# Altium project bms_sub.PrjPcb
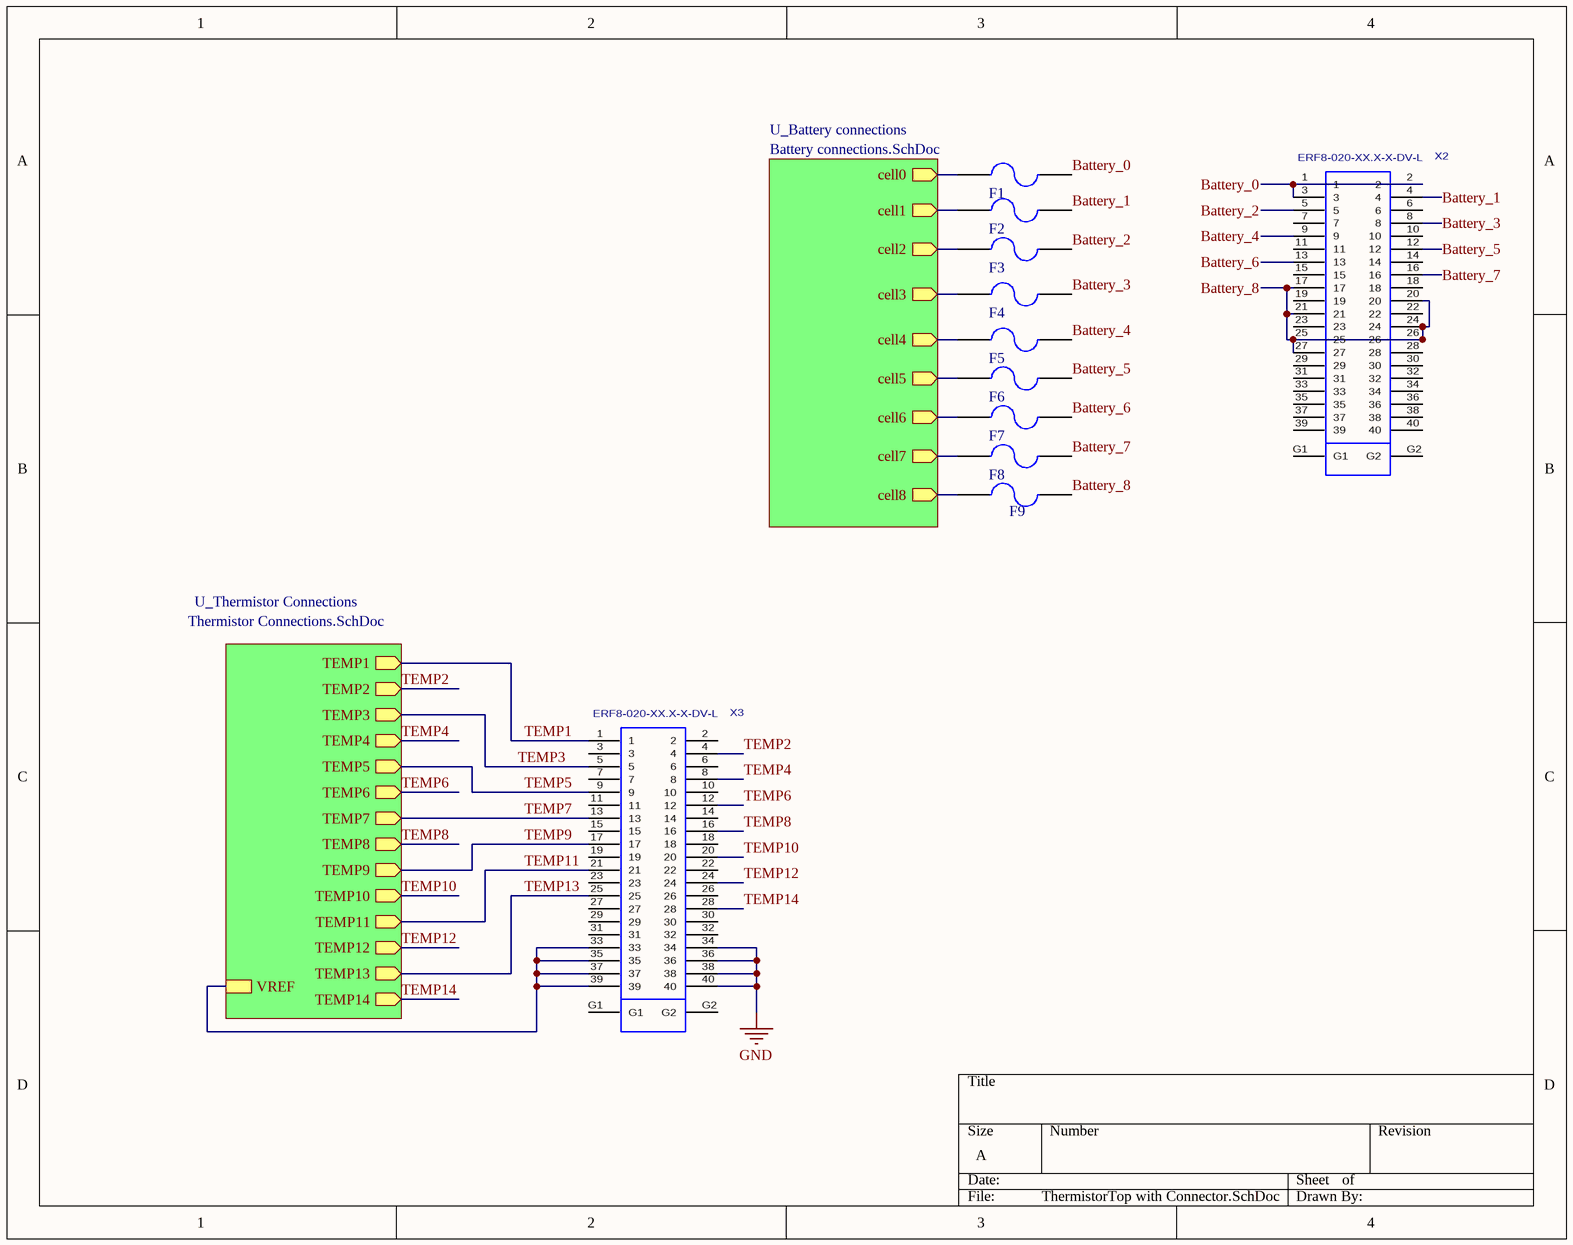
[diagram p0: ThermistorTop with Connector.SchDoc]
4 sheets, 62 parts. Net scope: hierarchical (ports join the sheet entries above them; power ports are global).
Board file: bms_sub.PcbDoc
Sheets:
  ThermistorTop with Connector.SchDoc
    U_Battery connections = Battery connections.SchDoc
    U_Thermistor Connections = Thermistor Connections.SchDoc
      U_Thermistor Linearization = Thermistor Linearization.SchDoc
      U_Thermistor Linearization = Thermistor Linearization.SchDoc
      U_Thermistor Linearization = Thermistor Linearization.SchDoc
      U_Thermistor Linearization = Thermistor Linearization.SchDoc
      U_Thermistor Linearization = Thermistor Linearization.SchDoc
      U_Thermistor Linearization = Thermistor Linearization.SchDoc
      U_Thermistor Linearization = Thermistor Linearization.SchDoc
      U_Thermistor Linearization = Thermistor Linearization.SchDoc
      U_Thermistor Linearization = Thermistor Linearization.SchDoc
      U_Thermistor Linearization = Thermistor Linearization.SchDoc
      U_Thermistor Linearization = Thermistor Linearization.SchDoc
      U_Thermistor Linearization = Thermistor Linearization.SchDoc
      U_Thermistor Linearization = Thermistor Linearization.SchDoc
      U_Thermistor Linearization = Thermistor Linearization.SchDoc

## Sheet ThermistorTop with Connector.SchDoc
size A

### Parts
(Parts that share a designator on the sheet are numbered #1, #2 ... from top to bottom, then left to right.)
F1  Fuse  [NTC 0805/2012]  (value not drawn)
F2  Fuse  [NTC 0805/2012]  (value not drawn)
F3  Fuse  [NTC 0805/2012]  (value not drawn)
F4  Fuse  [NTC 0805/2012]  (value not drawn)
F5  Fuse  [NTC 0805/2012]  (value not drawn)
F6  Fuse  [NTC 0805/2012]  (value not drawn)
F7  Fuse  [NTC 0805/2012]  (value not drawn)
F8  Fuse  [NTC 0805/2012]  (value not drawn)
F9  Fuse  [NTC 0805/2012]  (value not drawn)
X2#1  ERF8-020-XX.X-X-DV-L  [ERF8-020-XX.X-X-DV-L]
X3#1  ERF8-020-XX.X-X-DV-L  [ERF8-020-XX.X-X-DV-L]

### Sub-sheets
U_Battery connections = Battery connections.SchDoc: cell0 (out), cell1 (out), cell2 (out), cell3 (out), cell4 (out), cell5 (out), cell6 (out), cell7 (out), cell8 (out)
U_Thermistor Connections = Thermistor Connections.SchDoc: VREF, TEMP1 (out), TEMP2 (out), TEMP3 (out), TEMP4 (out), TEMP5 (out), TEMP6 (out), TEMP7 (out), TEMP8 (out), TEMP9 (out), TEMP10 (out), TEMP11 (out), TEMP12 (out), TEMP13 (out), TEMP14 (out)

### Nets
GND: X3#1.34 X3#1.36 X3#1.38 X3#1.40
Battery_0: F1.2 X2#1.1 X2#1.2 X2#1.3
Battery_1: F2.2 X2#1.4
Battery_2: F3.2 X2#1.5
Battery_3: F4.2 X2#1.8
Battery_4: F5.2 X2#1.9
Battery_5: F6.2 X2#1.12
Battery_6: F7.2 X2#1.13
Battery_7: F8.2 X2#1.16
Battery_8: F9.2 X2#1.17 X2#1.20 X2#1.21 X2#1.24 X2#1.25 X2#1.26 X2#1.27
TEMP1: X3#1.1 ; sheet U_Thermistor Connections/TEMP1
TEMP2: X3#1.4 ; sheet U_Thermistor Connections/TEMP2
TEMP3: X3#1.5 ; sheet U_Thermistor Connections/TEMP3
TEMP4: X3#1.8 ; sheet U_Thermistor Connections/TEMP4
TEMP5: X3#1.9 ; sheet U_Thermistor Connections/TEMP5
TEMP6: X3#1.12 ; sheet U_Thermistor Connections/TEMP6
TEMP7: X3#1.13 ; sheet U_Thermistor Connections/TEMP7
TEMP8: X3#1.16 ; sheet U_Thermistor Connections/TEMP8
TEMP9: X3#1.17 ; sheet U_Thermistor Connections/TEMP9
TEMP10: X3#1.20 ; sheet U_Thermistor Connections/TEMP10
TEMP11: X3#1.21 ; sheet U_Thermistor Connections/TEMP11
TEMP12: X3#1.24 ; sheet U_Thermistor Connections/TEMP12
TEMP13: X3#1.25 ; sheet U_Thermistor Connections/TEMP13
TEMP14: X3#1.28 ; sheet U_Thermistor Connections/TEMP14
NetBT1_1: F1.1 ; sheet U_Battery connections/cell0
NetBT2_1: F2.1 ; sheet U_Battery connections/cell1
NetBT3_1: F3.1 ; sheet U_Battery connections/cell2
NetBT4_1: F4.1 ; sheet U_Battery connections/cell3
NetBT5_1: F5.1 ; sheet U_Battery connections/cell4
NetBT6_1: F6.1 ; sheet U_Battery connections/cell5
NetBT7_1: F7.1 ; sheet U_Battery connections/cell6
NetBT8_1: F8.1 ; sheet U_Battery connections/cell7
NetBT9_1: F9.1 ; sheet U_Battery connections/cell8
NetRp1_1: X3#1.33 X3#1.35 X3#1.37 X3#1.39 ; sheet U_Thermistor Connections/VREF

Not connected (* = marked no-connect by the designer): X2#1 6 7 10 11 14 15 18 19 22 23 28 29 30 31 32 33 34 35 36 37 38 39 40 G1 G2; X3#1 2 3 6 7 10 11 14 15 18 19 22 23 26 27 29 30 31 32 G1 G2

### Library data of the parts
F1-F9 = 12: FUSE BOARD MOUNT 1A 32VDC 0805; id: 12; Name: MFU0805FF01000P100; itrip: 1; iinterrupt: 50; vmax: 32; quantity: 0; link: https://www.digikey.com/product-detail/en/vishay-beyschlag/MFU0805FF01000P100/MFU08051.00CT-ND/1206546; createdby: Haley
X2#1 X3#1 = 36: MANUFACTURER: SAMTEC; PCB DECAL: ERM8-020-XX.X-X-DV-L; id: 36; numcontacts: 40; numrows: 2; CREATED: August 17, 2016 - Wendy Xin; name: ERF8-020-XX.X-X-DV-L; quantity: 0; link: https://www.digikey.com/product-detail/en/samtec-inc/ERF8-020-05.0-S-DV-L-TR/SAM13554CT-ND/9593848; createdby: Haley

## Sheet Battery connections.SchDoc
size A
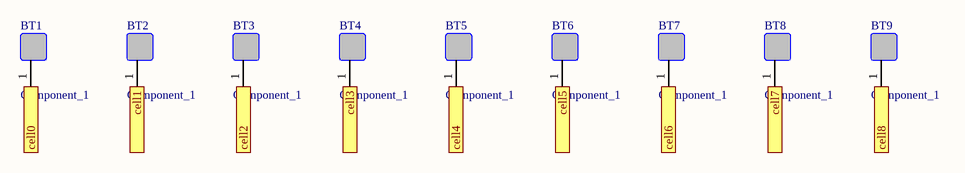
[diagram p1: Battery connections.SchDoc]

### Parts
BT1  Component_1  [Battery pad]
BT2  Component_1  [Battery pad]
BT3  Component_1  [Battery pad]
BT4  Component_1  [Battery pad]
BT5  Component_1  [Battery pad]
BT6  Component_1  [Battery pad]
BT7  Component_1  [Battery pad]
BT8  Component_1  [Battery pad]
BT9  Component_1  [Battery pad]

### Ports
cell0 (out), cell1 (out), cell2 (out), cell3 (out), cell4 (out), cell5 (out), cell6 (out), cell7 (out), cell8 (out)

### Nets
NetBT1_1: BT1.1(pin_1) ; port cell0
NetBT2_1: BT2.1(pin_1) ; port cell1
NetBT3_1: BT3.1(pin_1) ; port cell2
NetBT4_1: BT4.1(pin_1) ; port cell3
NetBT5_1: BT5.1(pin_1) ; port cell4
NetBT6_1: BT6.1(pin_1) ; port cell5
NetBT7_1: BT7.1(pin_1) ; port cell6
NetBT8_1: BT8.1(pin_1) ; port cell7
NetBT9_1: BT9.1(pin_1) ; port cell8

## Sheet Thermistor Connections.SchDoc
size A
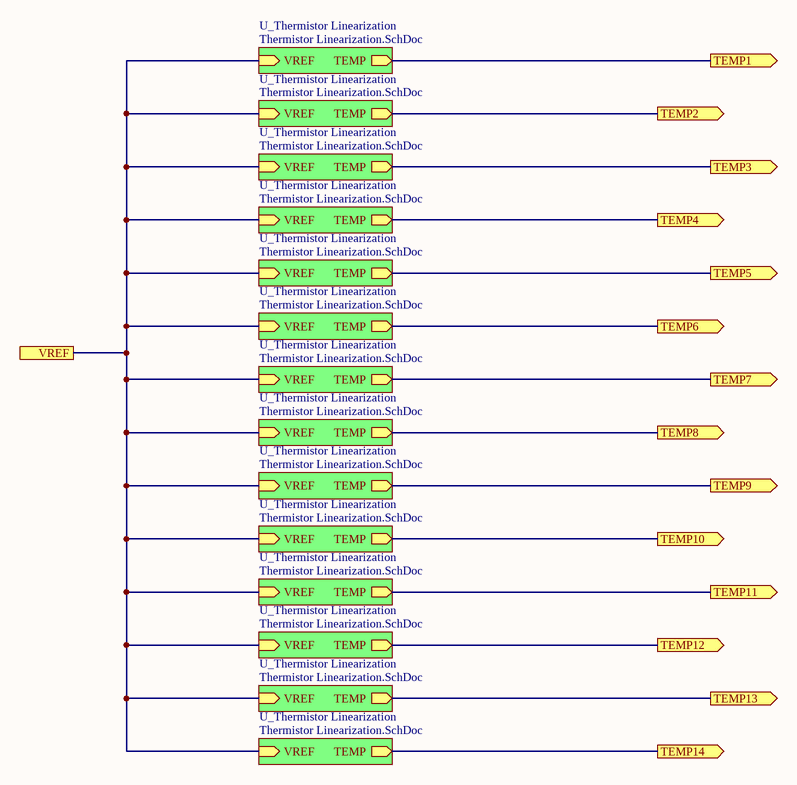
[diagram p2: Thermistor Connections.SchDoc]

### Sub-sheets
U_Thermistor Linearization = Thermistor Linearization.SchDoc: VREF (in), TEMP (out)
U_Thermistor Linearization = Thermistor Linearization.SchDoc: VREF (in), TEMP (out)
U_Thermistor Linearization = Thermistor Linearization.SchDoc: VREF (in), TEMP (out)
U_Thermistor Linearization = Thermistor Linearization.SchDoc: VREF (in), TEMP (out)
U_Thermistor Linearization = Thermistor Linearization.SchDoc: VREF (in), TEMP (out)
U_Thermistor Linearization = Thermistor Linearization.SchDoc: VREF (in), TEMP (out)
U_Thermistor Linearization = Thermistor Linearization.SchDoc: VREF (in), TEMP (out)
U_Thermistor Linearization = Thermistor Linearization.SchDoc: VREF (in), TEMP (out)
U_Thermistor Linearization = Thermistor Linearization.SchDoc: VREF (in), TEMP (out)
U_Thermistor Linearization = Thermistor Linearization.SchDoc: VREF (in), TEMP (out)
U_Thermistor Linearization = Thermistor Linearization.SchDoc: VREF (in), TEMP (out)
U_Thermistor Linearization = Thermistor Linearization.SchDoc: VREF (in), TEMP (out)
U_Thermistor Linearization = Thermistor Linearization.SchDoc: VREF (in), TEMP (out)
U_Thermistor Linearization = Thermistor Linearization.SchDoc: VREF (in), TEMP (out)

### Ports
TEMP1 (out), TEMP2 (out), TEMP3 (out), TEMP4 (out), TEMP5 (out), TEMP6 (out), TEMP7 (out), TEMP8 (out), TEMP9 (out), TEMP10 (out), TEMP11 (out), TEMP12 (out), TEMP13 (out), TEMP14 (out), VREF

### Nets
TEMP1: port TEMP1, sheet U_Thermistor Linearization/TEMP
TEMP2: port TEMP2, sheet U_Thermistor Linearization/TEMP
TEMP3: port TEMP3, sheet U_Thermistor Linearization/TEMP
TEMP4: port TEMP4, sheet U_Thermistor Linearization/TEMP
TEMP5: port TEMP5, sheet U_Thermistor Linearization/TEMP
TEMP6: port TEMP6, sheet U_Thermistor Linearization/TEMP
TEMP7: port TEMP7, sheet U_Thermistor Linearization/TEMP
TEMP8: port TEMP8, sheet U_Thermistor Linearization/TEMP
TEMP9: port TEMP9, sheet U_Thermistor Linearization/TEMP
TEMP10: port TEMP10, sheet U_Thermistor Linearization/TEMP
TEMP11: port TEMP11, sheet U_Thermistor Linearization/TEMP
TEMP12: port TEMP12, sheet U_Thermistor Linearization/TEMP
TEMP13: port TEMP13, sheet U_Thermistor Linearization/TEMP
TEMP14: port TEMP14, sheet U_Thermistor Linearization/TEMP
NetRp1_1: port VREF, sheet U_Thermistor Linearization/VREF, sheet U_Thermistor Linearization/VREF, sheet U_Thermistor Linearization/VREF, sheet U_Thermistor Linearization/VREF, sheet U_Thermistor Linearization/VREF, sheet U_Thermistor Linearization/VREF, sheet U_Thermistor Linearization/VREF, sheet U_Thermistor Linearization/VREF, sheet U_Thermistor Linearization/VREF, sheet U_Thermistor Linearization/VREF, sheet U_Thermistor Linearization/VREF, sheet U_Thermistor Linearization/VREF, sheet U_Thermistor Linearization/VREF, sheet U_Thermistor Linearization/VREF

## Sheet Thermistor Linearization.SchDoc
size A
Used 14 times, as channels U_Thermistor Connections/U_Thermistor Linearization, U_Thermistor Connections/U_Thermistor Linearization, U_Thermistor Connections/U_Thermistor Linearization, U_Thermistor Connections/U_Thermistor Linearization, U_Thermistor Connections/U_Thermistor Linearization, U_Thermistor Connections/U_Thermistor Linearization, U_Thermistor Connections/U_Thermistor Linearization, U_Thermistor Connections/U_Thermistor Linearization, U_Thermistor Connections/U_Thermistor Linearization, U_Thermistor Connections/U_Thermistor Linearization, U_Thermistor Connections/U_Thermistor Linearization, U_Thermistor Connections/U_Thermistor Linearization, U_Thermistor Connections/U_Thermistor Linearization, U_Thermistor Connections/U_Thermistor Linearization. Parts and nets are listed once, with the designators drawn on the sheet.
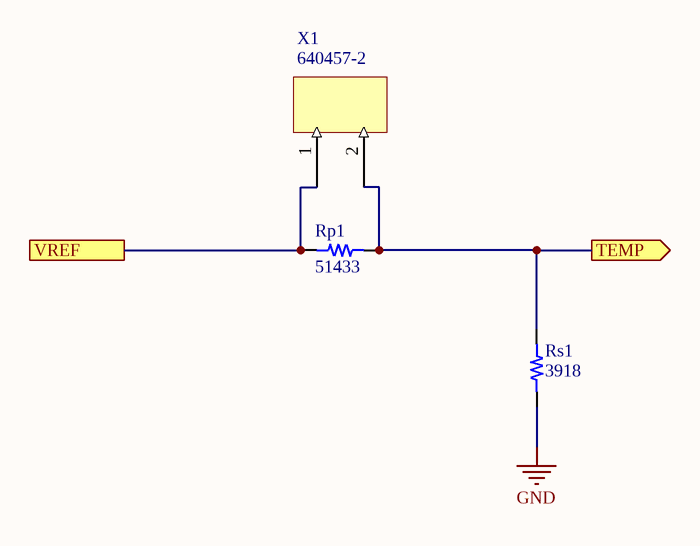
[diagram p3: Thermistor Linearization.SchDoc]

### Parts
Rp1  51433  [RES 0603/1608]
Rs1  3918  [RES 0603/1608]
X1  640457-2  [640457]

### Ports
TEMP (out), VREF

### Nets
GND: Rs1.1
TEMP: Rp1.2 Rs1.2 X1.2 ; port TEMP
VREF: Rp1.1 X1.1 ; port VREF

### Channels
U_Thermistor Connections/U_Thermistor Linearization: designators end in 4; ports TEMP=TEMP2 VREF=NetRp1_1
U_Thermistor Connections/U_Thermistor Linearization: designators end in 3; ports TEMP=TEMP3 VREF=NetRp1_1
U_Thermistor Connections/U_Thermistor Linearization: designators end in 2; ports TEMP=TEMP4 VREF=NetRp1_1
U_Thermistor Connections/U_Thermistor Linearization: designators end in 1; ports TEMP=TEMP5 VREF=NetRp1_1
U_Thermistor Connections/U_Thermistor Linearization: designators end in 0; ports TEMP=TEMP13 VREF=NetRp1_1
U_Thermistor Connections/U_Thermistor Linearization: designators Rp1=Rp9 Rs1=Rs9 X1=X9; ports TEMP=TEMP6 VREF=NetRp1_1
U_Thermistor Connections/U_Thermistor Linearization: designators Rp1=Rp8 Rs1=Rs8 X1=X8; ports TEMP=TEMP7 VREF=NetRp1_1
U_Thermistor Connections/U_Thermistor Linearization: designators Rp1=Rp7 Rs1=Rs7 X1=X7; ports TEMP=TEMP10 VREF=NetRp1_1
U_Thermistor Connections/U_Thermistor Linearization: designators Rp1=Rp6 Rs1=Rs6 X1=X6; ports TEMP=TEMP11 VREF=NetRp1_1
U_Thermistor Connections/U_Thermistor Linearization: designators Rp1=Rp5 Rs1=Rs5 X1=X5; ports TEMP=TEMP1 VREF=NetRp1_1
U_Thermistor Connections/U_Thermistor Linearization: designators Rp1=Rp4 Rs1=Rs4 X1=X4; ports TEMP=TEMP14 VREF=NetRp1_1
U_Thermistor Connections/U_Thermistor Linearization: designators Rp1=Rp3 Rs1=Rs3 X1=X3#2; ports TEMP=TEMP12 VREF=NetRp1_1
U_Thermistor Connections/U_Thermistor Linearization: designators Rp1=Rp2 Rs1=Rs2 X1=X2#2; ports TEMP=TEMP9 VREF=NetRp1_1
U_Thermistor Connections/U_Thermistor Linearization: ports TEMP=TEMP8 VREF=NetRp1_1

### Library data of the parts
Rp1 Rs1 = 1: id: 1; name: 0603 Resistor; percent tolerance: 5; package: 0603; quantity: 0
  Rp1: resistance: 51433
  Rs1: resistance: 3918
X1 = 37: 2 pin header; id: 37; numcontacts: 2; name: 640457-2; quantity: 0; createdby: Jason

## Nets that join several sheets
GND: ThermistorTop with Connector (X3#1.34 X3#1.36 X3#1.38 X3#1.40), U_Thermistor Connections/U_Thermistor Linearization (Rs14.1), U_Thermistor Connections/U_Thermistor Linearization (Rs13.1), U_Thermistor Connections/U_Thermistor Linearization (Rs12.1), U_Thermistor Connections/U_Thermistor Linearization (Rs11.1), U_Thermistor Connections/U_Thermistor Linearization (Rs10.1), U_Thermistor Connections/U_Thermistor Linearization (Rs9.1), U_Thermistor Connections/U_Thermistor Linearization (Rs8.1), U_Thermistor Connections/U_Thermistor Linearization (Rs7.1), U_Thermistor Connections/U_Thermistor Linearization (Rs6.1), U_Thermistor Connections/U_Thermistor Linearization (Rs5.1), U_Thermistor Connections/U_Thermistor Linearization (Rs4.1), U_Thermistor Connections/U_Thermistor Linearization (Rs3.1), U_Thermistor Connections/U_Thermistor Linearization (Rs2.1), U_Thermistor Connections/U_Thermistor Linearization (Rs1.1)
NetBT1_1: ThermistorTop with Connector (F1.1), Battery connections (BT1.1)
NetBT2_1: ThermistorTop with Connector (F2.1), Battery connections (BT2.1)
NetBT3_1: ThermistorTop with Connector (F3.1), Battery connections (BT3.1)
NetBT4_1: ThermistorTop with Connector (F4.1), Battery connections (BT4.1)
NetBT5_1: ThermistorTop with Connector (F5.1), Battery connections (BT5.1)
NetBT6_1: ThermistorTop with Connector (F6.1), Battery connections (BT6.1)
NetBT7_1: ThermistorTop with Connector (F7.1), Battery connections (BT7.1)
NetBT8_1: ThermistorTop with Connector (F8.1), Battery connections (BT8.1)
NetBT9_1: ThermistorTop with Connector (F9.1), Battery connections (BT9.1)
NetRp1_1: ThermistorTop with Connector (X3#1.33 X3#1.35 X3#1.37 X3#1.39), U_Thermistor Connections/U_Thermistor Linearization (Rp14.1 X14.1), U_Thermistor Connections/U_Thermistor Linearization (Rp13.1 X13.1), U_Thermistor Connections/U_Thermistor Linearization (Rp12.1 X12.1), U_Thermistor Connections/U_Thermistor Linearization (Rp11.1 X11.1), U_Thermistor Connections/U_Thermistor Linearization (Rp10.1 X10.1), U_Thermistor Connections/U_Thermistor Linearization (Rp9.1 X9.1), U_Thermistor Connections/U_Thermistor Linearization (Rp8.1 X8.1), U_Thermistor Connections/U_Thermistor Linearization (Rp7.1 X7.1), U_Thermistor Connections/U_Thermistor Linearization (Rp6.1 X6.1), U_Thermistor Connections/U_Thermistor Linearization (Rp5.1 X5.1), U_Thermistor Connections/U_Thermistor Linearization (Rp4.1 X4.1), U_Thermistor Connections/U_Thermistor Linearization (Rp3.1 X3#2.1), U_Thermistor Connections/U_Thermistor Linearization (Rp2.1 X2#2.1), U_Thermistor Connections/U_Thermistor Linearization (Rp1.1 X1.1)
TEMP1: ThermistorTop with Connector (X3#1.1), U_Thermistor Connections/U_Thermistor Linearization (Rp5.2 Rs5.2 X5.2)
TEMP2: ThermistorTop with Connector (X3#1.4), U_Thermistor Connections/U_Thermistor Linearization (Rp14.2 Rs14.2 X14.2)
TEMP3: ThermistorTop with Connector (X3#1.5), U_Thermistor Connections/U_Thermistor Linearization (Rp13.2 Rs13.2 X13.2)
TEMP4: ThermistorTop with Connector (X3#1.8), U_Thermistor Connections/U_Thermistor Linearization (Rp12.2 Rs12.2 X12.2)
TEMP5: ThermistorTop with Connector (X3#1.9), U_Thermistor Connections/U_Thermistor Linearization (Rp11.2 Rs11.2 X11.2)
TEMP6: ThermistorTop with Connector (X3#1.12), U_Thermistor Connections/U_Thermistor Linearization (Rp9.2 Rs9.2 X9.2)
TEMP7: ThermistorTop with Connector (X3#1.13), U_Thermistor Connections/U_Thermistor Linearization (Rp8.2 Rs8.2 X8.2)
TEMP8: ThermistorTop with Connector (X3#1.16), U_Thermistor Connections/U_Thermistor Linearization (Rp1.2 Rs1.2 X1.2)
TEMP9: ThermistorTop with Connector (X3#1.17), U_Thermistor Connections/U_Thermistor Linearization (Rp2.2 Rs2.2 X2#2.2)
TEMP10: ThermistorTop with Connector (X3#1.20), U_Thermistor Connections/U_Thermistor Linearization (Rp7.2 Rs7.2 X7.2)
TEMP11: ThermistorTop with Connector (X3#1.21), U_Thermistor Connections/U_Thermistor Linearization (Rp6.2 Rs6.2 X6.2)
TEMP12: ThermistorTop with Connector (X3#1.24), U_Thermistor Connections/U_Thermistor Linearization (Rp3.2 Rs3.2 X3#2.2)
TEMP13: ThermistorTop with Connector (X3#1.25), U_Thermistor Connections/U_Thermistor Linearization (Rp10.2 Rs10.2 X10.2)
TEMP14: ThermistorTop with Connector (X3#1.28), U_Thermistor Connections/U_Thermistor Linearization (Rp4.2 Rs4.2 X4.2)